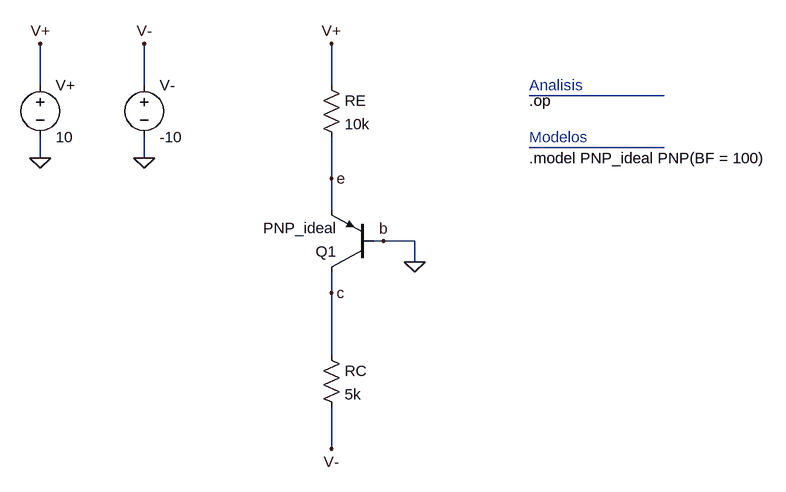
[diagram p0: schematic bjt_amp-ejemplo2_DC.asc]
bjt_amp-ejemplo2_DC.asc, the LTspice schematic file:
Version 4
SHEET 1 912 680
WIRE -464 -112 -464 -176
WIRE -304 -112 -304 -176
WIRE -16 -112 -16 -176
WIRE 496 -96 288 -96
WIRE 496 -16 288 -16
WIRE -464 0 -464 -32
WIRE -304 0 -304 -32
WIRE -16 32 -16 -32
WIRE -16 80 -16 32
WIRE 64 128 48 128
WIRE 112 128 64 128
WIRE 112 160 112 128
WIRE -16 208 -16 176
WIRE -16 304 -16 208
WIRE -16 448 -16 384
FLAG 112 160 0
FLAG -464 0 0
FLAG -464 -176 V+
FLAG -16 -176 V+
FLAG -304 0 0
FLAG -304 -176 V-
FLAG -16 448 V-
FLAG 64 128 b
FLAG -16 32 e
FLAG -16 208 c
SYMBOL res -32 -128 R0
SYMATTR InstName RE
SYMATTR Value 10k
SYMBOL voltage -464 -128 R0
WINDOW 123 0 0 Left 0
WINDOW 39 0 0 Left 0
SYMATTR InstName V+
SYMATTR Value 10
SYMBOL pnp 48 176 R180
SYMATTR InstName Q1
SYMATTR Value PNP_ideal
SYMBOL res -32 288 R0
SYMATTR InstName RC
SYMATTR Value 5k
SYMBOL voltage -304 -128 R0
WINDOW 123 0 0 Left 0
WINDOW 39 0 0 Left 0
SYMATTR InstName V-
SYMATTR Value -10
TEXT 288 -112 Left 2 ;Analisis
TEXT 288 -88 Left 2 !.op
TEXT 288 0 Left 2 !.model PNP_ideal PNP(BF = 100)
TEXT 288 -32 Left 2 ;Modelos

The netlist it stands for:
* bjt_amp-ejemplo2_DC.asc
RE V+ e 10k
V+ V+ 0 10
Q1 c 0 e 0 PNP_ideal
RC c V- 5k
V- V- 0 -10
.model NPN NPN
.model PNP PNP
.lib standard.bjt
* Analisis
.op
.model PNP_ideal PNP(BF = 100)
* Modelos
.backanno
.end

* Results of the author's LTspice run, read from the files saved beside the schematic
* Operating Point:
*   V(v+) = 10 V
*   V(e) = 771.9 mV
*   V(c) = -5.432 V
*   V(v-) = -10 V
*   Ic(Q1) = -913.7 µA
*   Ib(Q1) = -9.137 µA
*   Ie(Q1) = 922.8 µA
*   I(Rc) = 913.7 µA
*   I(Re) = 922.8 µA
*   I(V-) = 913.7 µA
*   I(V+) = -922.8 µA